# EAGLE design schematic (EAGLE 7.7.0)
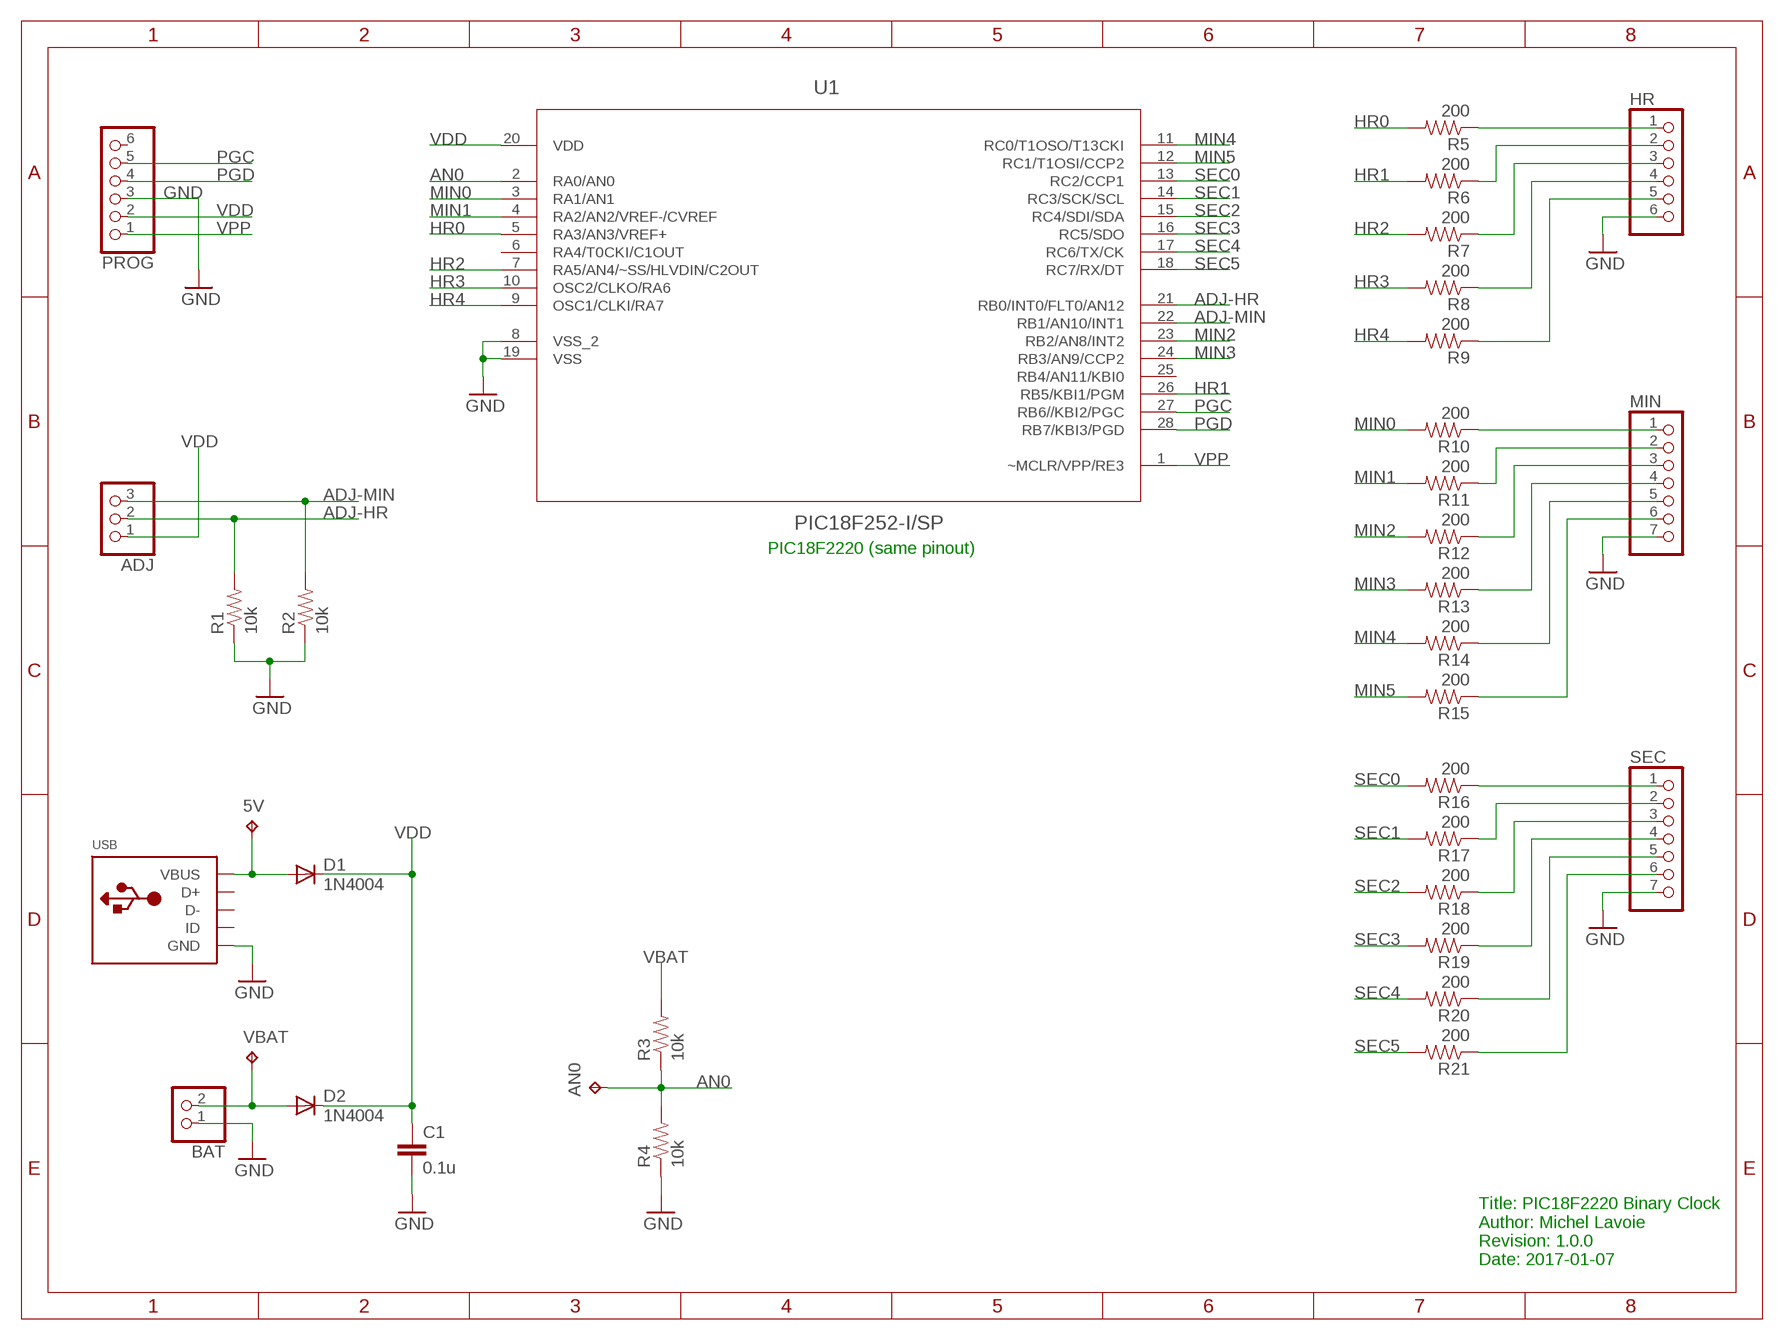
[diagram p0: schematic, sheet 1]

## Parts
5V  TPPAD1-13  [P1-13]
ADJ  PINHD-1X3  [1X03]
AN0  TPPAD1-13  [P1-13]
BAT  PINHD-1X2  [1X02]
C1  0.1u  0.1UF-50V-20%(PTH)KIT-EZ  [CAP-PTH-SMALL-KIT]
D1  1N4004  [DO41-10]
D2  1N4004  [DO41-10]
HR  PINHD-1X6  [1X06]
MIN  PINHD-1X7  [1X07]
PROG  PINHD-1X6  [1X06]
R1  10k  10KOHM-1/4W5%(PTH)  [AXIAL-0.3]
R2  10k  10KOHM-1/4W5%(PTH)  [AXIAL-0.3]
R3  10k  10KOHM-1/4W5%(PTH)  [AXIAL-0.3]
R4  10k  10KOHM-1/4W5%(PTH)  [AXIAL-0.3]
R5  200  10KOHM-1/4W5%(PTH)  [AXIAL-0.3]
R6  200  10KOHM-1/4W5%(PTH)  [AXIAL-0.3]
R7  200  10KOHM-1/4W5%(PTH)  [AXIAL-0.3]
R8  200  10KOHM-1/4W5%(PTH)  [AXIAL-0.3]
R9  200  10KOHM-1/4W5%(PTH)  [AXIAL-0.3]
R10  200  10KOHM-1/4W5%(PTH)  [AXIAL-0.3]
R11  200  10KOHM-1/4W5%(PTH)  [AXIAL-0.3]
R12  200  10KOHM-1/4W5%(PTH)  [AXIAL-0.3]
R13  200  10KOHM-1/4W5%(PTH)  [AXIAL-0.3]
R14  200  10KOHM-1/4W5%(PTH)  [AXIAL-0.3]
R15  200  10KOHM-1/4W5%(PTH)  [AXIAL-0.3]
R16  200  10KOHM-1/4W5%(PTH)  [AXIAL-0.3]
R17  200  10KOHM-1/4W5%(PTH)  [AXIAL-0.3]
R18  200  10KOHM-1/4W5%(PTH)  [AXIAL-0.3]
R19  200  10KOHM-1/4W5%(PTH)  [AXIAL-0.3]
R20  200  10KOHM-1/4W5%(PTH)  [AXIAL-0.3]
R21  200  10KOHM-1/4W5%(PTH)  [AXIAL-0.3]
SEC  PINHD-1X7  [1X07]
U1  PIC18F252-I/SP  [DIP254P762X508-28]
USB  USBTHM  [USB-MINIB-THM]
VBAT  TPPAD1-13  [P1-13]

## Nets
5V: 5V.TP D1.A USB.VBUS
ADJ-HR: ADJ.2 R1.P$2 U1.21(RB0/INT0/FLT0/AN12)
ADJ-MIN: ADJ.3 R2.P$2 U1.22(RB1/AN10/INT1)
AN0: AN0.TP R3.P$1 R4.P$2 U1.2(RA0/AN0)
GND: BAT.1 C1.2 HR.6 MIN.7 PROG.3 R1.P$1 R2.P$1 R4.P$1 SEC.7 U1.8(VSS_2) U1.19(VSS) USB.GND
HR0: R5.P$2 U1.5(RA3/AN3/VREF+)
HR1: R6.P$2 U1.26(RB5/KBI1/PGM)
HR2: R7.P$2 U1.7(RA5/AN4/~SS/HLVDIN/C2OUT)
HR3: R8.P$2 U1.10(OSC2/CLKO/RA6)
HR4: R9.P$2 U1.9(OSC1/CLKI/RA7)
MIN0: R10.P$2 U1.3(RA1/AN1)
MIN1: R11.P$2 U1.4(RA2/AN2/VREF-/CVREF)
MIN2: R12.P$2 U1.23(RB2/AN8/INT2)
MIN3: R13.P$2 U1.24(RB3/AN9/CCP2)
MIN4: R14.P$2 U1.11(RC0/T1OSO/T13CKI)
MIN5: R15.P$2 U1.12(RC1/T1OSI/CCP2)
N$1: HR.1 R5.P$1
N$2: HR.2 R6.P$1
N$3: HR.3 R7.P$1
N$4: HR.4 R8.P$1
N$5: HR.5 R9.P$1
N$11: MIN.1 R10.P$1
N$12: MIN.2 R11.P$1
N$13: MIN.3 R12.P$1
N$14: MIN.4 R13.P$1
N$15: MIN.5 R14.P$1
N$16: MIN.6 R15.P$1
N$17: R16.P$1 SEC.1
N$18: R17.P$1 SEC.2
N$19: R18.P$1 SEC.3
N$20: R19.P$1 SEC.4
N$21: R20.P$1 SEC.5
N$22: R21.P$1 SEC.6
PGC: PROG.5 U1.27(RB6//KBI2/PGC)
PGD: PROG.4 U1.28(RB7/KBI3/PGD)
SEC0: R16.P$2 U1.13(RC2/CCP1)
SEC1: R17.P$2 U1.14(RC3/SCK/SCL)
SEC2: R18.P$2 U1.15(RC4/SDI/SDA)
SEC3: R19.P$2 U1.16(RC5/SDO)
SEC4: R20.P$2 U1.17(RC6/TX/CK)
SEC5: R21.P$2 U1.18(RC7/RX/DT)
VBAT: BAT.2 D2.A R3.P$2 VBAT.TP
VDD: ADJ.1 C1.1 D1.C D2.C PROG.2 U1.20(VDD)
VPP: PROG.1 U1.1(~MCLR/VPP/RE3)
Unconnected: PROG.6 U1.6(RA4/T0CKI/C1OUT) U1.25(RB4/AN11/KBI0) USB.D+ USB.D- USB.ID

## Notes on the sheet
- PIC18F2220 (same pinout)
- Title: PIC18F2220 Binary Clock
  Author: Michel Lavoie
  Revision: 1.0.0
  Date: 2017-01-07

## Library data of the parts
5V AN0 VBAT = testpad:TP: Test pad
ADJ = pinhead:PINHD-1X3: PIN HEADER
BAT = pinhead:PINHD-1X2: PIN HEADER
C1 = SparkFun-Capacitors:0.1UF-50V-20%(PTH): CAP-08370; PROD_ID: CAP-08370
D1 D2 = adafruit:1N4004: DIODE General purpose 1N400x type rectifier (With bigger pads) http://www.ladyada.net/library/pcb/eaglelibrary.html
HR PROG = pinhead:PINHD-1X6: PIN HEADER
MIN SEC = pinhead:PINHD-1X7: PIN HEADER
R1-R4 = SparkFun-Resistors:10KOHM-1/4W5%(PTH): RES-09435; PROD_ID: RES-9435
R5-R21 = SparkFun-Resistors:10KOHM-1/4W5%(PTH): RES-09435; PROD_ID: RES-9435; VALUE: 10k
U1 = Microchip_By_element14_Batch_1:PIC18F252-I/SP: Enhanced Flash Microcontroller; DESCRIPTION: Enhanced Flash Microcontroller; MPN: PIC18F252-I/SP; OC_FARNELL: 1523970; OC_NEWARK: 61K3471; PACKAGE: DIP-28; SUPPLIER: Microchip
USB = adafruit:USB: USB Connectors USBMINIB - Surface Mount Female Mini-B USB Connector 4UConnector: 06564 By microbuilder.eu Thru-hole RA Female Mini-B USB Connector 4UConnector: 18732 By ladyada.net

## Board
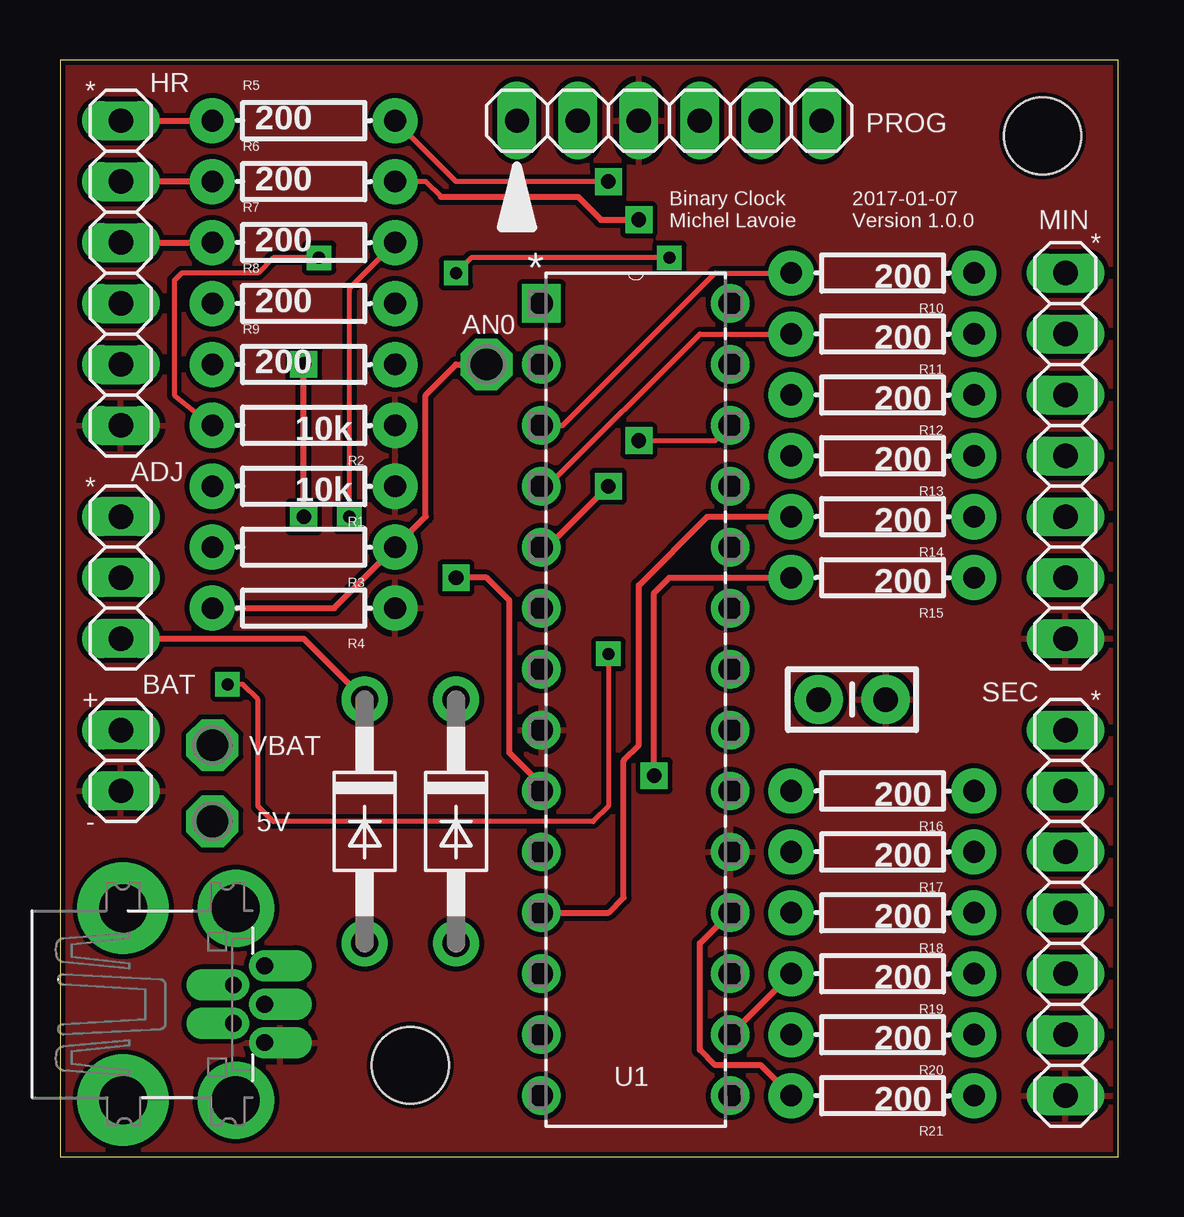
[diagram p1: board, top side]
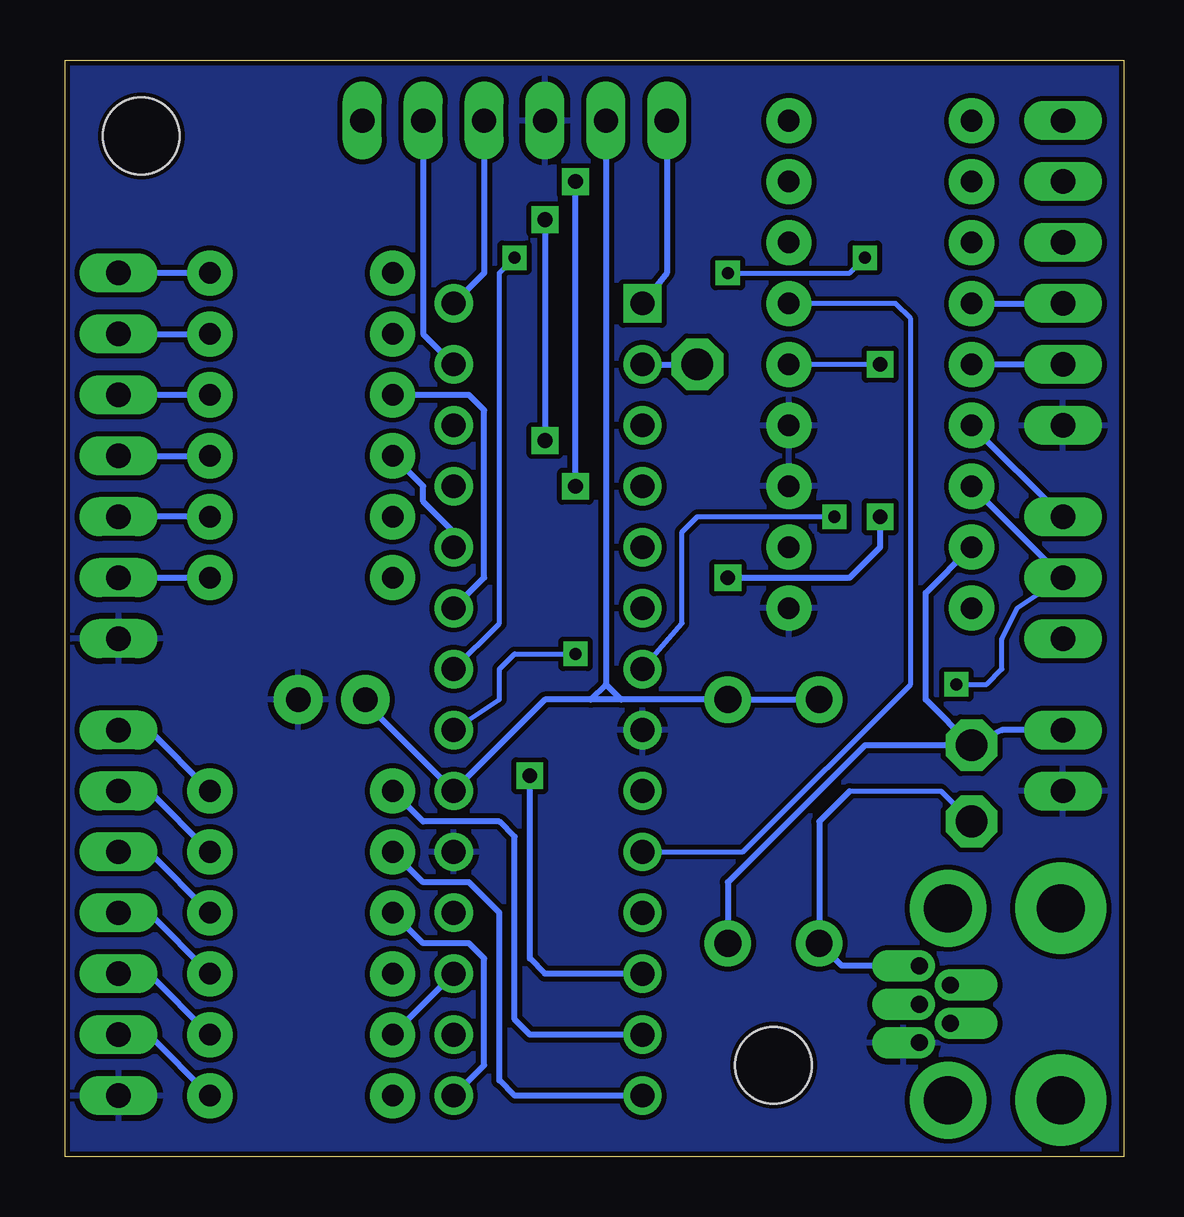
[diagram p2: board, bottom side, seen from below]

Size 44.12 x 45.71 mm. Coordinates in mm from the lower left corner, seen from the top.
Outline: 0,0 44.12,0 44.12,45.71 0,45.71 0,0
Copper layers (1*16): Top 0.035mm / dielectric 1.5mm / Bottom 0.035mm
Design rules "SparkFun": minimum track width 8mil, minimum drill 20mil, track to track 8mil, track to pad 8mil, pad to pad 8mil, via to via 8mil, smd to smd 8mil, copper to edge 8mil, drill to drill 8mil, minimum pad ring 12mil, minimum via ring 10mil, stop-mask expansion 4mil, vias tented up to drill 20mil, thermal gap 10mil
Holes 3.2 mm at 40.96,42.55 14.61,3.81

### Footprints (pad centres in the part's own frame; a part is rotated, then mirrored left to right if it is on the bottom)
P1-13 = drill 1.321 pad 2.159 octagon: TP 0,0
1X03 = drill 1.016 long: 1 -2.54,0; 2 0,0; 3 2.54,0
1X02 = drill 1.016 long: 1 -1.27,0; 2 1.27,0
CAP-PTH-SMALL-KIT = drill 1.016 pad 2.032: 1 -1.397,0; 2 1.397,0
DO41-10 = drill 1.118 pad 1.93: A 5.08,0; C -5.08,0
1X06 = drill 1.016 long: 1 -6.35,0; 2 -3.81,0; 3 -1.27,0; 4 1.27,0; 5 3.81,0; 6 6.35,0
1X07 = drill 1.016 long: 1 -7.62,0; 2 -5.08,0; 3 -2.54,0; 4 0,0; 5 2.54,0; 6 5.08,0; 7 7.62,0
AXIAL-0.3 = drill 0.9 pad 1.88: P$1 -3.81,0; P$2 3.81,0
DIP254P762X508-28 = drill 0.991 square: 1 -7.874,33.02 | drill 0.991: 2 -7.874,30.48; 3 -7.874,27.94; 4 -7.874,25.4; 5 -7.874,22.86; 6 -7.874,20.32; 7 -7.874,17.78; 8 -7.874,15.24; 9 -7.874,12.7; 10 -7.874,10.16; 11 -7.874,7.62; 12 -7.874,5.08; 13 -7.874,2.54; 14 -7.874,0; 15 0,0; 16 0,2.54; 17 0,5.08; 18 0,7.62; 19 0,10.16; 20 0,12.7; 21 0,15.24; 22 0,17.78; 23 0,20.32; 24 0,22.86; 25 0,25.4; 26 0,27.94; 27 0,30.48; 28 0,33.02
USB-MINIB-THM = drill 0.7 offset: D+ 0,9.8; D- -0.8,8.5; GND 1.6,9.8; ID 0.8,8.5; VBUS -1.6,9.8 | drill 2 pad 3.81: GND1 -4,3.9; GND4 4,3.9 | drill 2 pad 3.2: GND2 -4,8.6; GND3 4,8.6

### Placement (x,y rotation side)
5V  6.35,13.97 0 top
ADJ  2.54,24.13 90 top
AN0  17.78,33.02 0 top
BAT  2.54,16.51 90 top
C1  33.02,19.05 0 top
D1  12.7,13.97 270 top
D2  16.51,13.97 270 top
HR  2.54,36.83 270 top
MIN  41.91,29.21 270 top
PROG  25.4,43.18 0 top
R1  10.16,27.94 180 top
R2  10.16,30.48 180 top
R3  10.16,25.4 180 top
R4  10.16,22.86 180 top
R5  10.16,43.18 0 top
R6  10.16,40.64 0 top
R7  10.16,38.1 0 top
R8  10.16,35.56 0 top
R9  10.16,33.02 0 top
R10  34.29,36.83 180 top
R11  34.29,34.29 180 top
R12  34.29,31.75 180 top
R13  34.29,29.21 180 top
R14  34.29,26.67 180 top
R15  34.29,24.13 180 top
R16  34.29,15.24 180 top
R17  34.29,12.7 180 top
R18  34.29,10.16 180 top
R19  34.29,7.62 180 top
R20  34.29,5.08 180 top
R21  34.29,2.54 180 top
SEC  41.91,10.16 270 top
U1  27.94,2.54 0 top
USB  -1.27,6.35 270 top
VBAT  6.35,17.14 0 top

### Tracks (layer width: path | path; a pad name or v marks a point on that pad's centre or on a via)
5V
  Bottom 0.203: 11.43,15.24 7.62,15.24 5V.TP
  Bottom 0.254: USB.VBUS 11.76,7.95 D1.A 12.7,13.97 11.43,15.24
ADJ-HR  (via drill 0.51)
  Top 0.203: v22.86,20.95 22.86,14.61 22.23,13.97 8.89,13.97 8.26,14.61 8.26,19.05 7.62,19.68 v6.99,19.68
  Bottom 0.203: U1.21 26.04,19.05 26.04,20.32 25.4,20.95 v22.86,20.95 | v6.99,19.68 5.71,19.68 5.08,20.32 5.08,21.59 4.45,22.86 ADJ.2
  Bottom 0.254: ADJ.2 R1.P$2
ADJ-MIN  (via drill 0.51)
  Top 0.203: v25.4,37.47 17.14,37.47 v16.51,36.83 | v10.79,37.47 8.89,37.47 8.26,36.83 5.08,36.83 4.76,36.51 4.76,31.75 R2.P$2
  Bottom 0.203: U1.22 26.04,22.23 26.04,36.83 v25.4,37.47 | v16.51,36.83 11.43,36.83 v10.79,37.47
  Bottom 0.254: ADJ.3 R2.P$2
AN0
  Top 0.254: R4.P$2 11.43,22.86 R3.P$1 15.24,26.67 15.24,31.75 16.51,33.02 AN0.TP
  Bottom 0.254: U1.2 AN0.TP
GND
  pour Top: 0,0 44.45,0 44.45,45.72 0,45.72
  pour Bottom: 0,0 44.45,0 44.45,45.72 0,45.72
HR0  (via drill 0.61)
  Top 0.203: v22.86,40.64 16.51,40.64 R5.P$2
  Top 0.254: U1.5 20.32,25.4 v22.86,27.94
  Bottom 0.254: v22.86,27.94 v22.86,40.64
HR1  (via drill 0.61)
  Top 0.203: 15.88,40.01 15.24,40.64 R6.P$2 | v24.13,29.84 27.3,29.84 U1.26
  Top 0.254: 15.88,40.01 21.59,40.01 22.54,39.05 v24.13,39.05
  Bottom 0.254: v24.13,39.05 v24.13,29.84
HR2  (via drill 0.51)
  Top 0.203: v12.06,26.67 12.06,36.2 R7.P$2
  Bottom 0.203: U1.7 18.41,22.23 18.41,26.04 17.78,26.67 v12.06,26.67
HR3
  Bottom 0.203: U1.10 15.88,12.7 8.89,19.68 8.89,34.92 9.53,35.56 R8.P$2
HR4  (via drill 0.61)
  Top 0.254: U1.9 20.07,15.49 18.73,16.83 18.73,23.18 17.78,24.13 v16.51,24.13 | v10.16,26.67 v10.16,33.02
  Bottom 0.203: v10.16,33.02 R9.P$2
  Bottom 0.254: v16.51,24.13 11.43,24.13 10.16,25.4 v10.16,26.67
MIN0
  Top 0.203: U1.3 20.95,30.48 27.3,36.83 R10.P$2
MIN1
  Top 0.203: U1.4 20.32,27.94 26.67,34.29 R11.P$2
MIN2
  Bottom 0.254: U1.23 26.67,24.13 26.67,31.11 27.3,31.75 R12.P$2
MIN3
  Bottom 0.254: U1.24 27.94,26.04 29.21,27.3 29.21,27.94 R13.P$2
MIN4
  Top 0.254: U1.11 22.86,10.16 23.5,10.79 23.5,16.51 24.13,17.14 24.13,23.81 26.99,26.67 R14.P$2
MIN5  (via drill 0.61)
  Top 0.254: v24.77,15.88 24.77,23.5 25.4,24.13 R15.P$2
  Bottom 0.254: U1.12 24.13,7.62 24.77,8.26 v24.77,15.88
N$1
  Top 0.254: HR.1 R5.P$1
N$2
  Top 0.254: R6.P$1 HR.2
N$3
  Top 0.254: HR.3 R7.P$1
N$4
  Bottom 0.254: R8.P$1 HR.4
N$5
  Bottom 0.254: HR.5 R9.P$1
N$11
  Bottom 0.254: R10.P$1 MIN.1
N$12
  Bottom 0.254: MIN.2 R11.P$1
N$13
  Bottom 0.254: R12.P$1 MIN.3
N$14
  Bottom 0.254: MIN.4 R13.P$1
N$15
  Bottom 0.254: R14.P$1 MIN.5
N$16
  Bottom 0.254: MIN.6 R15.P$1
N$17
  Bottom 0.254: SEC.1 40.64,17.78 R16.P$1
N$18
  Bottom 0.254: SEC.2 40.64,15.24 R17.P$1
N$19
  Bottom 0.254: SEC.3 40.64,12.7 R18.P$1
N$20
  Bottom 0.254: SEC.4 40.64,10.16 R19.P$1
N$21
  Bottom 0.254: SEC.5 40.64,7.62 R20.P$1
N$22
  Bottom 0.254: SEC.6 40.64,5.08 R21.P$1
PGC
  Bottom 0.254: PROG.5 29.21,34.29 U1.27
PGD
  Bottom 0.254: PROG.4 26.67,36.83 U1.28
SEC0
  Bottom 0.254: U1.13 24.77,5.08 25.4,5.71 25.4,13.34 26.04,13.97 29.21,13.97 R16.P$2
SEC1
  Bottom 0.254: U1.14 25.4,2.54 26.04,3.17 26.04,10.16 27.3,11.43 29.21,11.43 R17.P$2
SEC2
  Bottom 0.254: U1.15 26.67,3.81 26.67,8.26 27.3,8.89 29.21,8.89 R18.P$2
SEC3
  Top 0.254: U1.16 R19.P$2
SEC4
  Bottom 0.254: U1.17 R20.P$2
SEC5
  Top 0.254: R21.P$2 29.21,3.81 27.3,3.81 26.67,4.45 26.67,8.89 U1.18
VBAT
  Bottom 0.254: BAT.2 5.08,17.78 VBAT.TP | VBAT.TP 8.26,19.05 8.26,23.5 R3.P$2 | VBAT.TP 10.79,17.14 16.51,11.43 D2.A
VDD
  Top 0.254: ADJ.1 10.16,21.59 D1.C
  Bottom 0.254: D1.C D2.C 20.95,19.05 | 20.95,19.05 22.23,19.05 | 22.23,19.05 24.13,19.05 U1.20 31.75,19.05 C1.1 | PROG.2 21.59,19.68 | 21.59,19.68 20.95,19.05 | 21.59,19.68 22.23,19.05
VPP
  Bottom 0.254: PROG.1 19.05,36.83 U1.1

### Text on the board
tNames: * | Binary Clock / Michel Lavoie | 2017-01-07 / Version 1.0.0 | * | * | + | * | -